# Altium schematic sheet PAGE04_POWER & DECOUPLI.SchDoc
size 386 x 284 mm
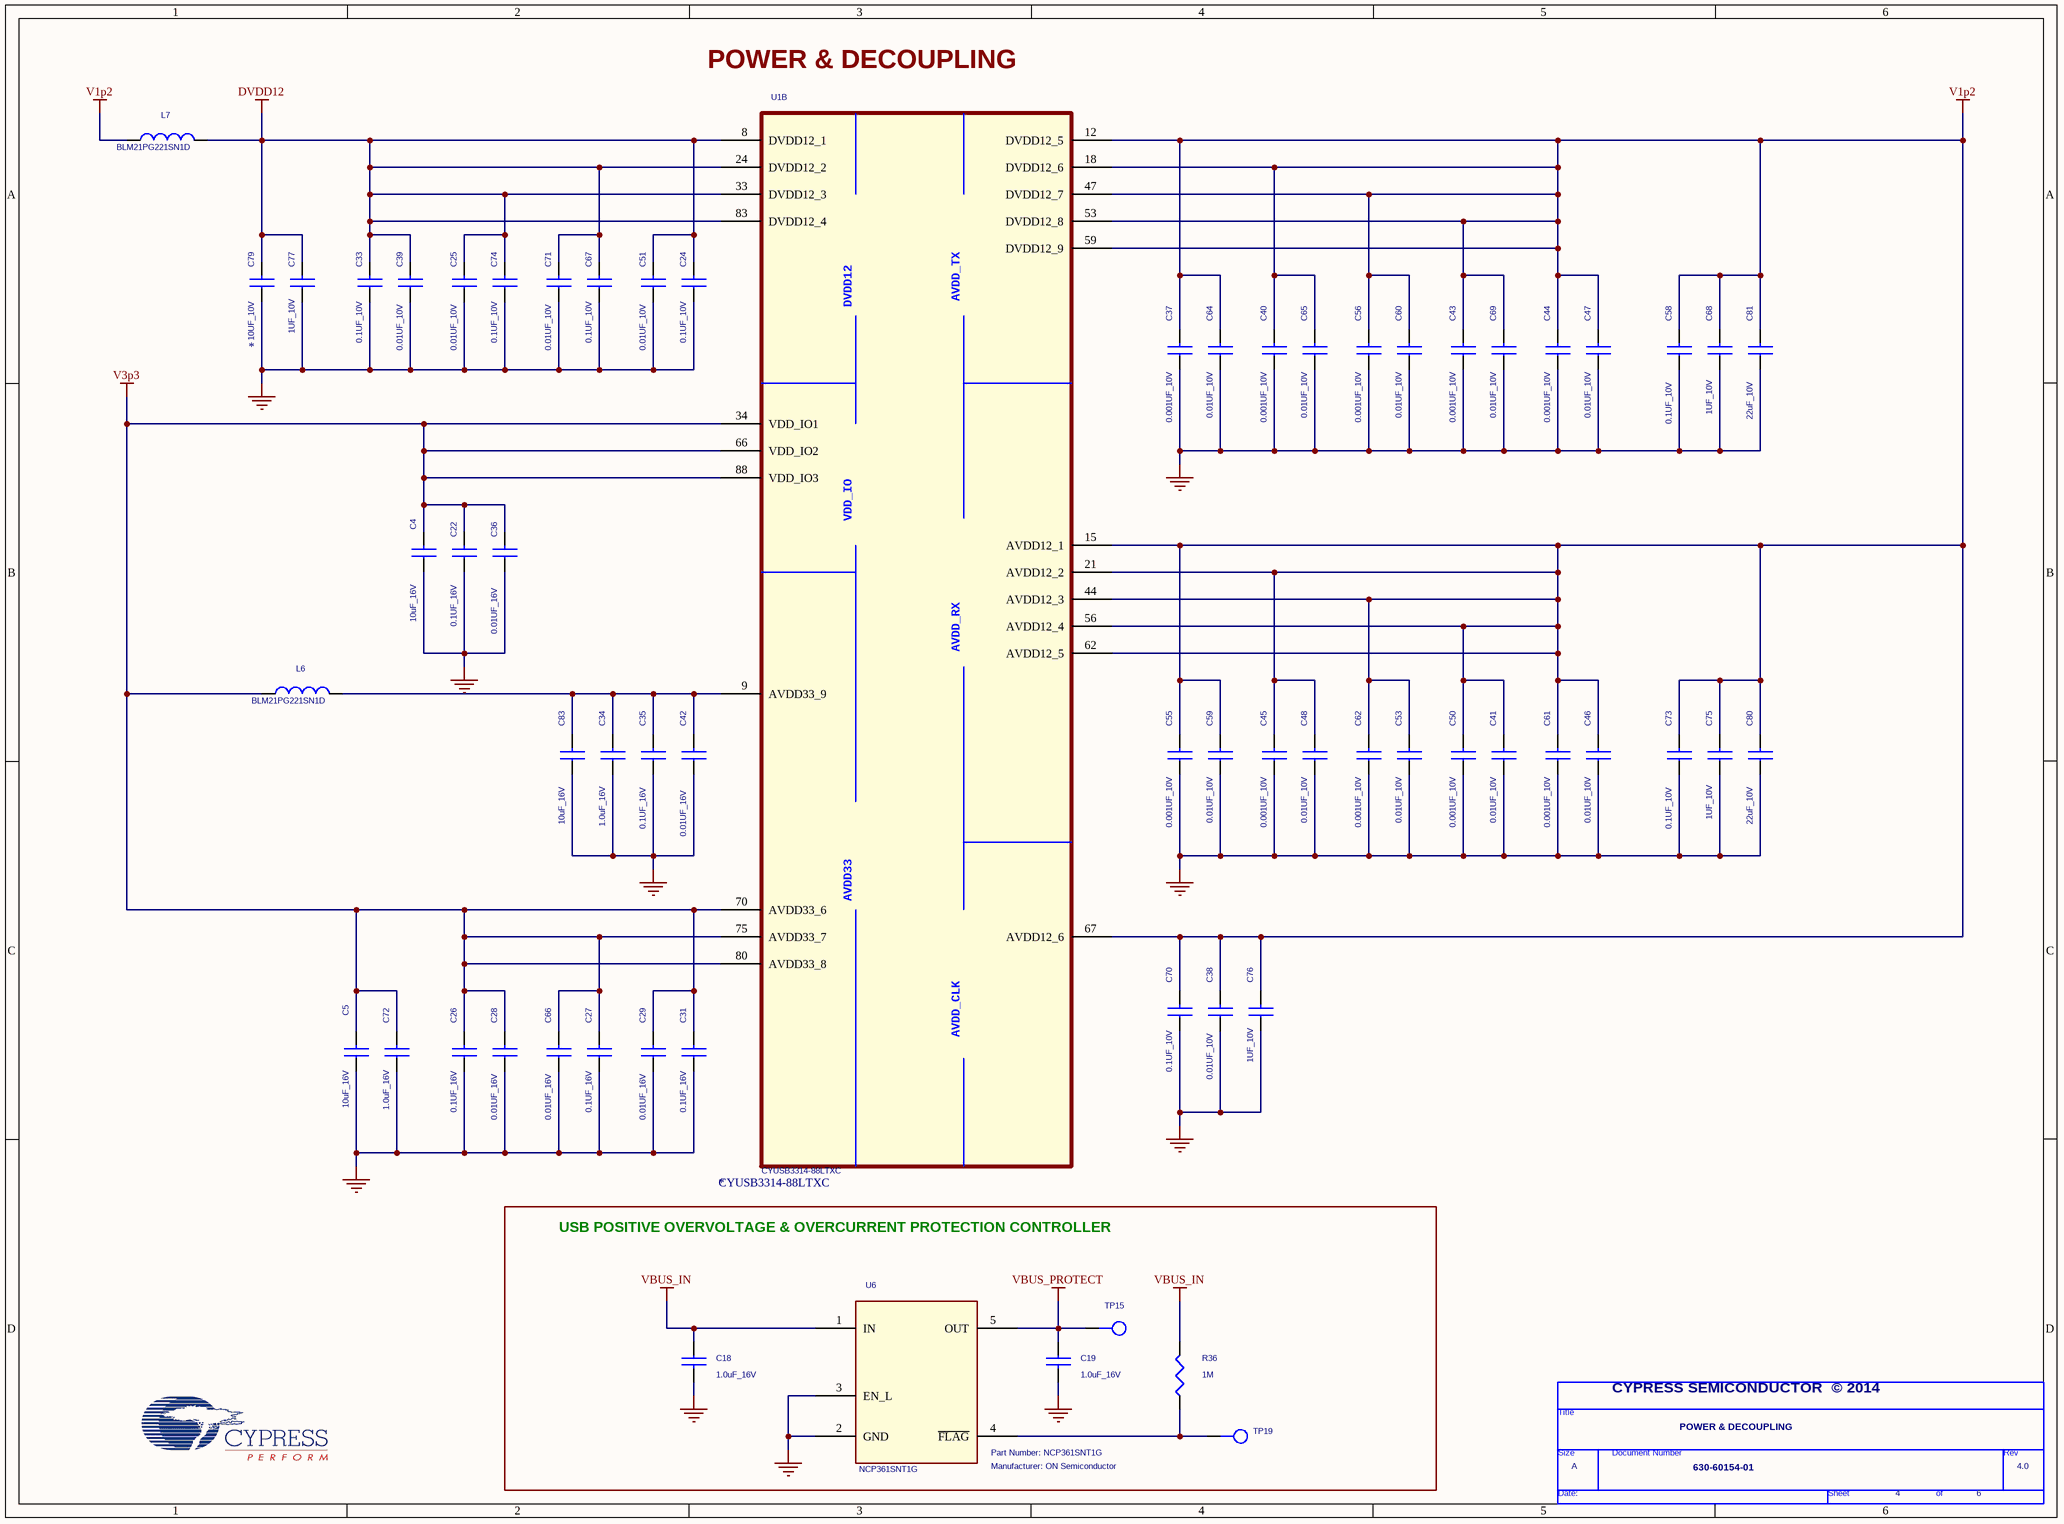
[diagram p0: PAGE04_POWER & DECOUPLI.SchDoc]

## Parts
*  Page Count: 6  Page Number: 4  Page Size: A  Title: POWER & DECOUPLING  RevCode: 4.0  Doc: 630-60154-01  (hidden comment: TitleBlock0)  (graphical)
C4  10uF_16V  [CAPC1608X90M]
C5  10uF_16V  [CAPC1608X90M]
C18  1.0uF_16V  [CAPC1608X90M]
C19  1.0uF_16V  [CAPC1608X90M]
C22  0.1UF_16V  [CAPC1005X56M]
C24  0.1UF_10V  [CAPC1005X56M]
C25  0.01UF_10V  [CAPC1005X56M]
C26  0.1UF_16V  [CAPC1005X56M]
C27  0.1UF_16V  [CAPC1005X56M]
C28  0.01UF_16V  [CAPC1005X56M]
C29  0.01UF_16V  [CAPC1005X56M]
C31  0.1UF_16V  [CAPC1005X56M]
C33  0.1UF_10V  [CAPC1005X56M]
C34  1.0uF_16V  [CAPC1005X56M]
C35  0.1UF_16V  [CAPC1005X56M]
C36  0.01UF_16V  [CAPC1005X56M]
C37  0.001UF_10V  [CAPC1005X56M]
C38  0.01UF_10V  [CAPC1005X56M]
C39  0.01UF_10V  [CAPC1005X56M]
C40  0.001UF_10V  [CAPC1005X56M]
C41  0.01UF_10V  [CAPC1005X56M]
C42  0.01UF_16V  [CAPC1005X56M]
C43  0.001UF_10V  [CAPC1005X56M]
C44  0.001UF_10V  [CAPC1005X56M]
C45  0.001UF_10V  [CAPC1005X56M]
C46  0.01UF_10V  [CAPC1005X56M]
C47  0.01UF_10V  [CAPC1005X56M]
C48  0.01UF_10V  [CAPC1005X56M]
C50  0.001UF_10V  [CAPC1005X56M]
C51  0.01UF_10V  [CAPC1005X56M]
C53  0.01UF_10V  [CAPC1005X56M]
C55  0.001UF_10V  [CAPC1005X56M]
C56  0.001UF_10V  [CAPC1005X56M]
C58  0.1UF_10V  [CAPC1005X56M]
C59  0.01UF_10V  [CAPC1005X56M]
C60  0.01UF_10V  [CAPC1005X56M]
C61  0.001UF_10V  [CAPC1005X56M]
C62  0.001UF_10V  [CAPC1005X56M]
C64  0.01UF_10V  [CAPC1005X56M]
C65  0.01UF_10V  [CAPC1005X56M]
C66  0.01UF_16V  [CAPC1005X56M]
C67  0.1UF_10V  [CAPC1005X56M]
C68  1UF_10V  [CAPC1005X56M]
C69  0.01UF_10V  [CAPC1005X56M]
C70  0.1UF_10V  [CAPC1005X56M]
C71  0.01UF_10V  [CAPC1005X56M]
C72  1.0uF_16V  [CAPC1005X56M]
C73  0.1UF_10V  [CAPC1005X56M]
C74  0.1UF_10V  [CAPC1005X56M]
C75  1UF_10V  [CAPC1005X56M]
C76  1UF_10V  [CAPC1005X56M]
C77  1UF_10V  [CAPC1005X56M]
C79  10UF_10V  [CAPC1608X90M]
C80  22uF_10V  [CAPC1608X90M]
C81  22uF_10V  [CAPC1608X90M]
C83  10uF_16V  [CAPC1608X90M]
L6  BLM21PG221SN1D  [INDC2012X105M]
L7  BLM21PG221SN1D  [INDC2012X105M]
R36  1M  [RESC1005X40M]
TP15  TP_RED  [KEYSTONE_5000]  (value not drawn)
TP19  TP_YEL  [KEYSTONE_5000]  (value not drawn)
U1  CYUSB3314-88LTXC  [QFN40P1000X1000X100-89M]  (part B of 3)
U6  NCP361SNT1G  Manufacturer: ON Semiconductor  [SOP95P275X110-5M]

## Blocks framed on the sheet
USB POSITIVE OVERVOLTAGE & OVERCURRENT PROTECTION CONTROLLER: C18 C19 R36 TP15 TP19 U6

## Nets
DVDD12: C24.2 C25.2 C33.2 C39.2 C51.2 C67.2 C71.2 C74.2 C77.2 C79.2 L7.2 U1.8(DVDD12_1) U1.24(DVDD12_2) U1.33(DVDD12_3) U1.83(DVDD12_4)
GND: C4.1 C5.1 C18.2 C19.2 C22.1 C24.1 C25.1 C26.1 C27.1 C28.1 C29.1 C31.1 C33.1 C34.1 C35.1 C36.1 C37.1 C38.1 C39.1 C40.1 C41.1 C42.1 C43.1 C44.1 C45.1 C46.1 C47.1 C48.1 C50.1 C51.1 C53.1 C55.1 C56.1 C58.1 C59.1 C60.1 C61.1 C62.1 C64.1 C65.1 C66.1 C67.1 C68.1 C69.1 C70.1 C71.1 C72.1 C73.1 C74.1 C75.1 C76.1 C77.1 C79.1 C80.1 C81.1 C83.1 U6.2(GND) U6.3(EN_L)
V1p2: C37.2 C38.2 C40.2 C41.2 C43.2 C44.2 C45.2 C46.2 C47.2 C48.2 C50.2 C53.2 C55.2 C56.2 C58.2 C59.2 C60.2 C61.2 C62.2 C64.2 C65.2 C68.2 C69.2 C70.2 C73.2 C75.2 C76.2 C80.2 C81.2 L7.1 U1.12(DVDD12_5) U1.15(AVDD12_1) U1.18(DVDD12_6) U1.21(AVDD12_2) U1.44(AVDD12_3) U1.47(DVDD12_7) U1.53(DVDD12_8) U1.56(AVDD12_4) U1.59(DVDD12_9) U1.62(AVDD12_5) U1.67(AVDD12_6)
V3p3: C4.2 C5.2 C22.2 C26.2 C27.2 C28.2 C29.2 C31.2 C36.2 C66.2 C72.2 L6.1 U1.34(VDD_IO1) U1.66(VDD_IO2) U1.70(AVDD33_6) U1.75(AVDD33_7) U1.80(AVDD33_8) U1.88(VDD_IO3)
VBUS_IN: C18.1 R36.2 U6.1(IN)
VBUS_PROTECT: C19.1 TP15.1(TP) U6.5(OUT)
NetC34_2: C34.2 C35.2 C42.2 C83.2 L6.2 U1.9(AVDD33_9)
NetR36_1: R36.1 TP19.1(TP) U6.4(~{FLAG})

## Notes on the sheet
- POWER & DECOUPLING
- CYPRESS SEMICONDUCTOR  © 2014
- (in symbol CYUSB3314-88LTXC_2, part B) AVDD_TX; DVDD12; VDD_IO; AVDD_RX; AVDD33; AVDD_CLK
- (in symbol TitleBlock0) Title; Size; Document Number; Rev; Date:; Sheet; of

## Library data of the parts
C4 C5 C22 C24-C29 C31 C33-C48 C50 C51 C53 C55 C56 C58-C62 C64-C77 C79-C81 C83 = CAPACITOR NON-POL: Manufacturer: *; Part Number: *
  C39: Decription: *
C18 C19 = CAP: CAP - CER, 1uF, 10V, +/-10%, X5R, 0402; Part Class: CAPACITORS; Num Pins: 2; Item Num: P03-15479R; RoHS Compliant: Yes; Lead Free Status: Yes
L6 L7 = INDUCTOR: FERRITE CHIP 220 OHM 2A 0805; Manufacturer: Murata; DEVICE: L4; Lead Free: YES; Part Number: BLM21PG221SN1D
R36 = R: RES 1.00M OHM 1/10W 1% 0402 SMD; Manufacturer: Panasonic; Part Number: ERJ-2RKF1004X
TP15 = TP: TEST POINT PC MINI .040"D RED; PART_NUMBER: 5000; Manufacturer: Keystone
TP19 = TP: TEST POINT PC MINI .040"D RED; Manufacturer: Keystone; PART_NUMBER: 5000
U1 = CYUSB3314-88LTXC_2: Manufacturer: *; Part Number: CYUSB3314-88LTXC
U6 = NCP361SNT1G_0: IC USB POS OVP/OC_TSOP5; Part Number: NCP361SNT1G
* = TitleBlock0: Page Create Date: March  8, 1995